# Altium schematic sheet Power.SchDoc
size A
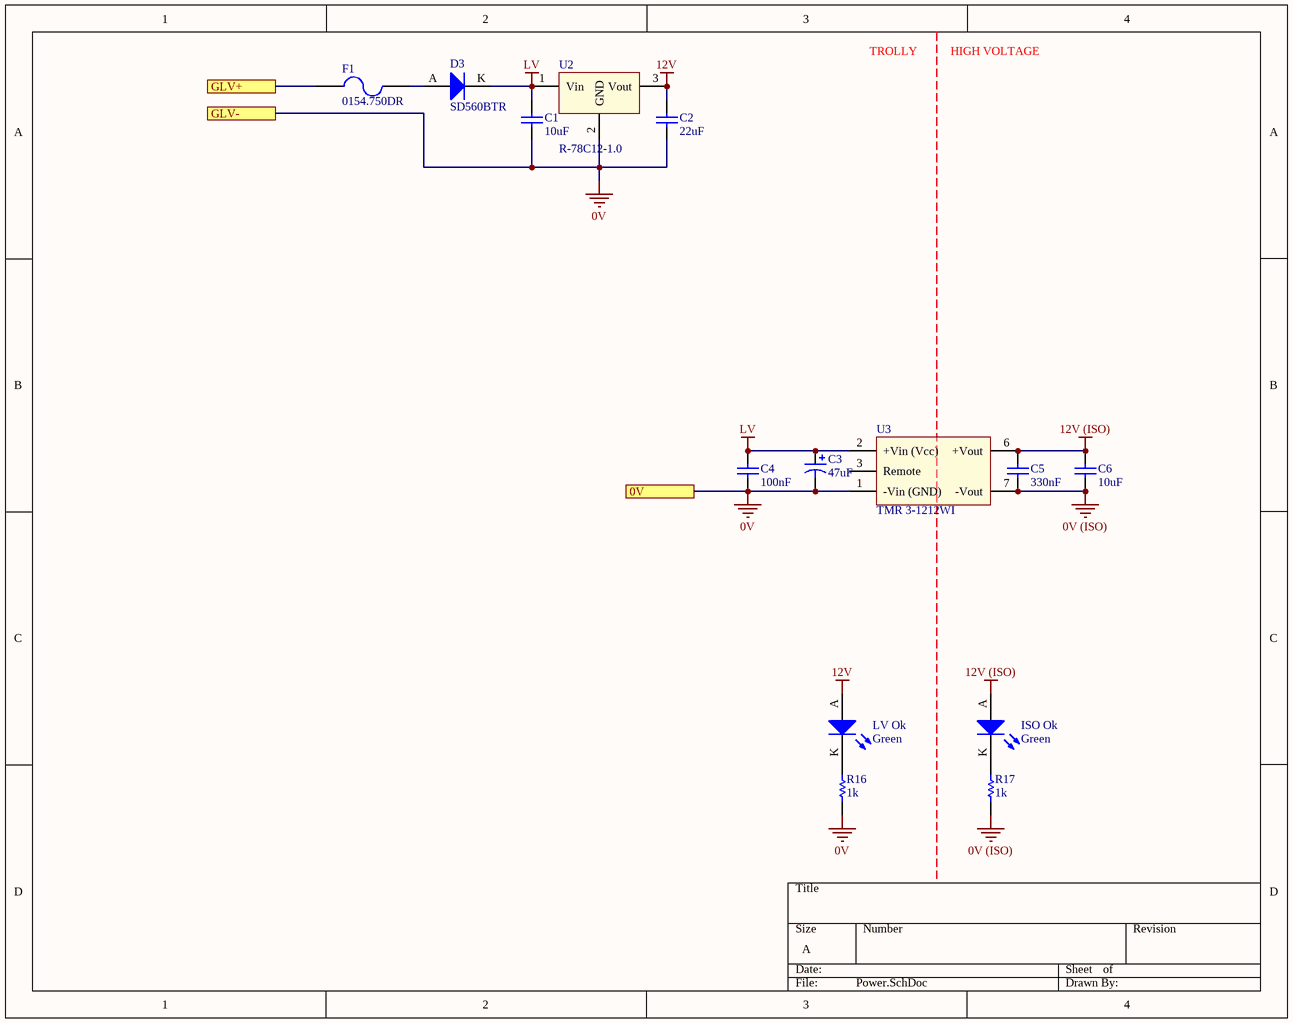
[diagram p0: Power.SchDoc]

## Parts
C1  10uF  [0805]
C2  22uF  [1206]
C3  47uF  [2924]
C4  100nF  [0805]
C5  330nF  [0805]
C6  10uF  [0805]
D3  SD560BTR  [SMB Diode]
F1  0154.750DR  [Omni BLOK 0154]
ISO_Ok  Green  [0805 LED]
LV_Ok  Green  [0805 LED]
R16  1k  [0805]
R17  1k  [0805]
U2  R-78C12-1.0  [RECOM 3-SIP]
U3  TMR 3-1212WI  [TRECO 8-SIP]

## Ports
0V, GLV+, GLV-

## Nets
0V: C1.1 C2.1 C3.1 C4.1 R16.1 U2.2(GND) U3.1(-Vin_(GND)) ; port GLV-, port 0V
0V (ISO): C5.1 C6.1 R17.1 U3.7(-Vout)
12V: C2.2 LV_Ok.A U2.3(Vout)
12V (ISO): C5.2 C6.2 ISO_Ok.A U3.6(+Vout)
LV: C1.2 C3.2 C4.2 D3.K U2.1(Vin) U3.2(+Vin_(Vcc))
GLV+: F1.1 ; port GLV+
NetD3_A: D3.A F1.2
NetISO_Ok_K: ISO_Ok.K R17.2
NetLV_Ok_K: LV_Ok.K R16.2

Not connected (* = marked no-connect by the designer): U3 3(Remote)

## Notes on the sheet
- TROLLY
- HIGH VOLTAGE

## Library data of the parts
C1 C6 = GRM21BR6YA106KE43L: Manufacturer: muRata; Tolerance: 10%; Material: X5R; Rated Voltage: 50V; Part Number: GRM21BR6YA106KE43L; Value: 10uF; Digikey Part Number: 490-10514-6-ND
C2 = CC1206MKX5R7BB226: Manufacturer: YAGEO; Tolerance: 20%; Material: Ceramic; Rated Voltage: 16V; Part Number: CC1206MKX5R7BB226; Value: 22uF; Digikey Part Number: 311-1997-2-ND
C3 = TAJV476K035RNJ: Manufacturer: AVX Corporation; Tolerance: 10%; Material: Tantalum; Rated Voltage: 35V; Part Number: TAJV476K035RNJ; Value: 47uF; Digikey Part Number: 478-8934-1-ND
C4 = GCM21BR71H104KA37L: Manufacturer: muRata; Tolerance: ±10%; Material: X7R; Rated Voltage: 50V; Part Number: GCM21BR71H104KA37L; Value: 100nF; Digikey Part Number: 490-6064-1-ND
C5 = GCM219R71H334KA55D: Manufacturer: muRata; Tolerance: ±10%; Material: X7R; Rated Voltage: 50V; Part Number: GCM219R71H334KA55D; Value: 330nF; Digikey Part Number: 490-8045-1-ND
D3 = SD560BTR: 1.2V_F 600V 5A SMB; Manufacturer: SMC Diode Solutions; Part Number: SD560BTR; Digikey Part Number: 1655-1530-2-ND; Digikey Link: https://www.digikey.com/product-detail/en/smc-diode-solutions/SD560BTR/1655-1530-2-ND/6022620
F1 = 0154.750DR: FUSE BOARD MNT 750MA 125VAC/VDC; Manufacturer: LittelFuse Inc; Part Number: 0154.750DR; Digikey Part Number: F1221CT-ND; Digikey Link: https://www.digikey.com/product-detail/en/littelfuse-inc/0154.750DR/F1221CT-ND/183370
ISO_Ok LV_Ok = SML-210FTT86: Green LED Indication - Discrete 1.75V 0805 (2012 Metric); Manufacturer: ROHM Semiconductor; Part Number: SML-210FTT86; Colour: Green; Digikey Part Number: 511-1285-1-ND; Digikey Link: https://www.digikey.com/product-detail/en/rohm-semiconductor/SML-210FTT86/511-1285-1-ND/637098
R16 R17 = RC0805FR071KL: Manufacturer: YAGEO; Tolerance: 0.01; Rated Voltage: 0.125W; Part Number: RC0805FR071KL; Value: 1k; Material: FR-07; Digikey Part Number: 311-1.00KCRCT-ND
U2 = R-78C12-1.0: 3PIN DC DC CONVERTER 12V 12W; Manufacturer: Recom; Isolation: Non-Isolated; Part Number: R-78C12-1.0; Digikey Part Number: 945-1392-5-ND; Digikey Link: https://www.digikey.com/products/en/power-supplies-board-mount/dc-dc-converters/922?k=R-78C&k=&pkeyword=R-78C&sv=0&pv1525=44&sf=0&FV=ffe0039a&quantity=&ColumnSort=0&page=1&pageSize=25
U3 = TMR 3-1212WI: DC DC CONVERTER 12V 3W; Manufacturer: Traco Power; Isolation: Isolated; Part Number: TMR 3-1212WI; Digikey Part Number: 1951-2367-ND; Digikey Link: https://www.digikey.com.au/product-detail/en/traco-power/TMR-3-1212WI/1951-2367-ND/9383402